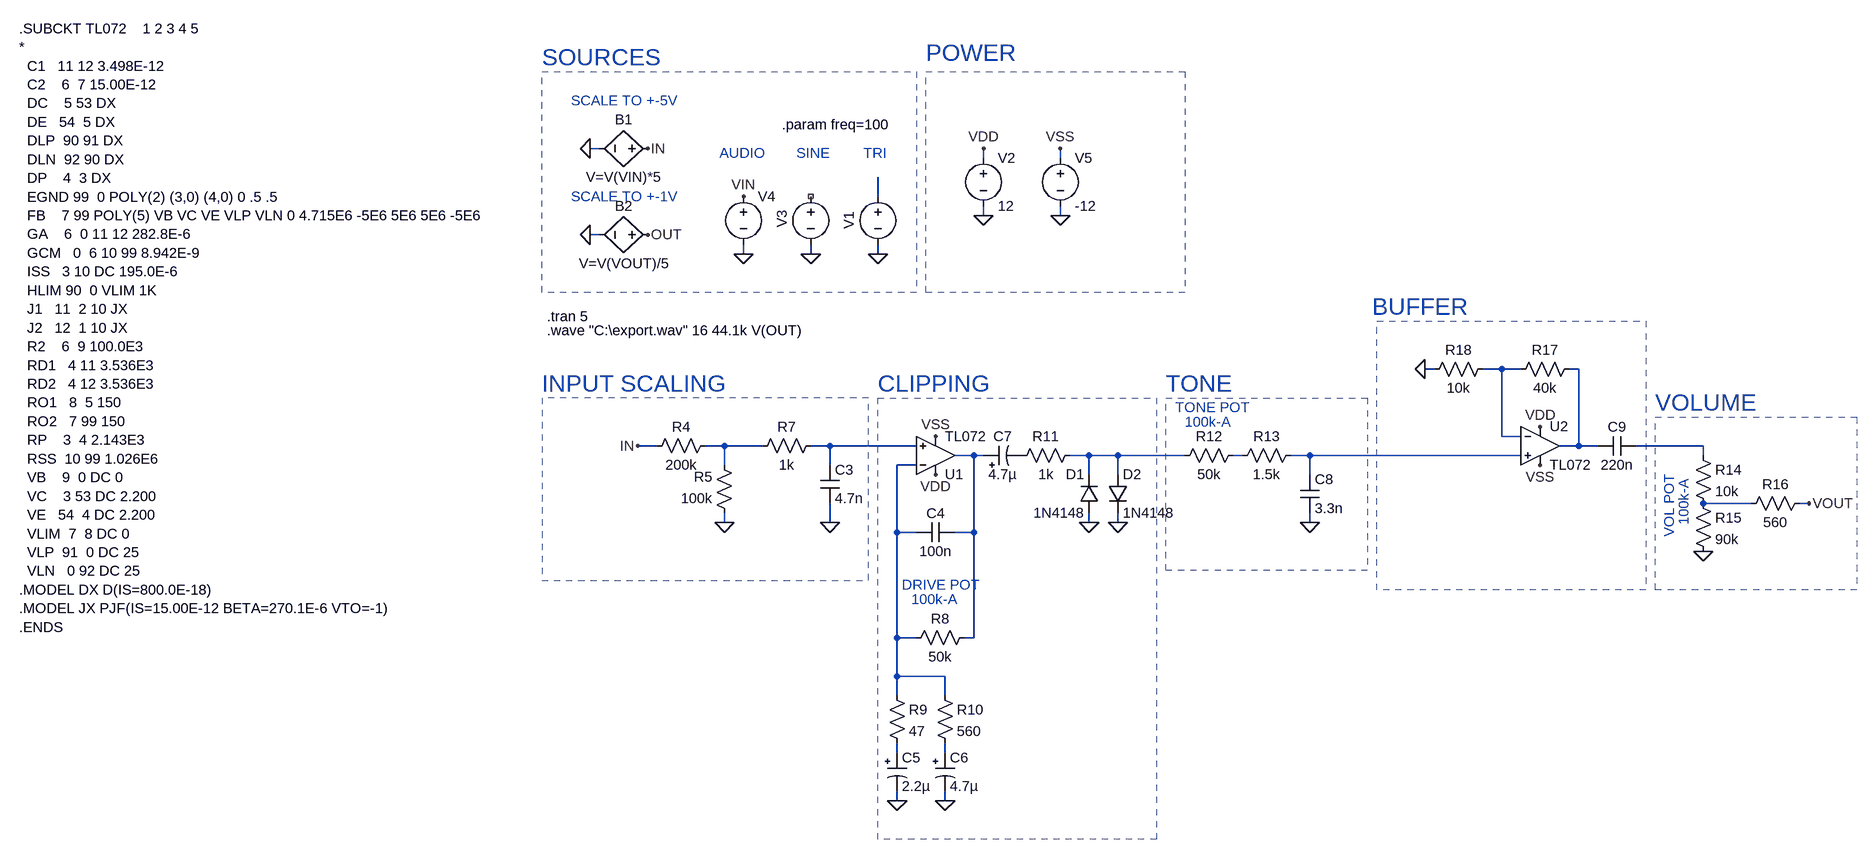
[diagram p0: schematic dist.asc]
dist.asc, the LTspice schematic file:
Version 4
SHEET 1 1972 1292
WIRE -160 112 -176 112
WIRE 480 128 480 112
WIRE 608 128 608 112
WIRE 304 192 304 160
WIRE 480 224 480 208
WIRE 608 224 608 208
WIRE -160 256 -176 256
WIRE 80 288 80 272
WIRE 192 288 192 272
WIRE 304 288 304 272
WIRE 1232 480 1216 480
WIRE 1344 480 1312 480
WIRE 1376 480 1344 480
WIRE 1472 480 1456 480
WIRE 1344 592 1344 480
WIRE 1376 592 1344 592
WIRE -64 608 -96 608
WIRE 48 608 16 608
WIRE 112 608 48 608
WIRE 224 608 192 608
WIRE 368 608 224 608
WIRE 1472 608 1472 480
WIRE 1472 608 1440 608
WIRE 1504 608 1472 608
WIRE 1680 608 1568 608
WIRE 464 624 432 624
WIRE 480 624 464 624
WIRE 656 624 624 624
WIRE 704 624 656 624
WIRE 816 624 704 624
WIRE 912 624 896 624
WIRE 1024 624 992 624
WIRE 1376 624 1024 624
WIRE 1680 624 1680 608
WIRE 48 640 48 608
WIRE 224 640 224 608
WIRE 368 640 336 640
WIRE 656 656 656 624
WIRE 704 656 704 624
WIRE 1024 656 1024 624
WIRE 1760 704 1680 704
WIRE 1856 704 1840 704
WIRE 48 736 48 720
WIRE 224 736 224 704
WIRE 656 736 656 720
WIRE 704 736 704 720
WIRE 1024 736 1024 720
WIRE 336 752 336 640
WIRE 368 752 336 752
WIRE 464 752 464 624
WIRE 464 752 432 752
WIRE 336 928 336 752
WIRE 368 928 336 928
WIRE 464 928 464 752
WIRE 464 928 448 928
WIRE 336 992 336 928
WIRE 416 992 336 992
WIRE 336 1024 336 992
WIRE 416 1024 416 992
WIRE 336 1120 336 1104
WIRE 416 1120 416 1104
WIRE 336 1200 336 1184
WIRE 416 1200 416 1184
FLAG 80 192 VIN
FLAG -80 112 IN
FLAG -80 256 OUT
FLAG -96 608 IN
FLAG 400 592 VSS
FLAG 400 656 VDD
FLAG 1856 704 VOUT
FLAG 1408 576 VDD
FLAG 1408 640 VSS
FLAG 608 224 0
FLAG 480 224 0
FLAG 608 112 VSS
FLAG 480 112 VDD
FLAG 80 288 0
FLAG 1680 784 0
FLAG 1024 736 0
FLAG 704 736 0
FLAG 656 736 0
FLAG 336 1200 0
FLAG 416 1200 0
FLAG 224 736 0
FLAG 1216 480 0
FLAG 48 736 0
FLAG 192 288 0
FLAG 304 288 0
FLAG -176 112 0
FLAG -176 256 0
SYMBOL voltage 304 176 R0
WINDOW 0 -32 56 VBottom 2
WINDOW 3 32 56 Invisible 2
WINDOW 123 0 0 Left 0
WINDOW 39 0 0 Left 0
SYMATTR InstName V1
SYMATTR Value PULSE(0 250m 0 {0.5/freq} {0.5/freq} 0 {1/freq})
SYMBOL voltage 480 112 R0
WINDOW 123 0 0 Left 0
WINDOW 39 0 0 Left 0
SYMATTR InstName V2
SYMATTR Value 12
SYMBOL voltage 192 176 R0
WINDOW 0 -47 39 VRight 2
WINDOW 3 24 96 Invisible 2
WINDOW 123 0 0 Left 0
WINDOW 39 0 0 Left 0
SYMATTR InstName V3
SYMATTR Value SINE(0 1 {freq})
SYMBOL voltage 80 176 R0
WINDOW 3 24 96 Invisible 2
SYMATTR Value wavefile="C:\input.wav" chan=0
SYMATTR InstName V4
SYMBOL bv -64 112 R90
WINDOW 0 -32 56 VBottom 2
WINDOW 3 32 56 VTop 2
SYMATTR InstName B1
SYMATTR Value V=V(VIN)*5
SYMBOL bv -64 256 R90
WINDOW 0 -32 56 VBottom 2
WINDOW 3 32 56 VTop 2
SYMATTR InstName B2
SYMATTR Value V=V(VOUT)/5
SYMBOL res 32 592 R90
WINDOW 0 0 56 VBottom 2
WINDOW 3 32 56 VTop 2
SYMATTR InstName R4
SYMATTR Value 200k
SYMBOL res 64 736 R180
WINDOW 0 36 76 Left 2
WINDOW 3 36 40 Left 2
SYMATTR InstName R5
SYMATTR Value 100k
SYMBOL OpAmps\\opamp2 400 688 M180
SYMATTR InstName U1
SYMATTR Value TL072
SYMBOL res 208 592 R90
WINDOW 0 0 56 VBottom 2
WINDOW 3 32 56 VTop 2
SYMATTR InstName R7
SYMATTR Value 1k
SYMBOL cap 208 640 R0
SYMATTR InstName C3
SYMATTR Value 4.7n
SYMBOL cap 432 736 R90
WINDOW 0 0 32 VBottom 2
WINDOW 3 32 32 VTop 2
SYMATTR InstName C4
SYMATTR Value 100n
SYMBOL res 464 912 R90
WINDOW 0 0 56 VBottom 2
WINDOW 3 32 56 VTop 2
SYMATTR InstName R8
SYMATTR Value 50k
SYMBOL res 320 1008 R0
SYMATTR InstName R9
SYMATTR Value 47
SYMBOL res 400 1008 R0
SYMATTR InstName R10
SYMATTR Value 560
SYMBOL polcap 320 1120 R0
SYMATTR InstName C5
SYMATTR Value 2.2µ
SYMBOL polcap 400 1120 R0
SYMATTR InstName C6
SYMATTR Value 4.7µ
SYMBOL polcap 480 640 R270
WINDOW 0 32 32 VTop 2
WINDOW 3 0 32 VBottom 2
SYMATTR InstName C7
SYMATTR Value 4.7µ
SYMBOL res 640 608 R90
WINDOW 0 0 56 VBottom 2
WINDOW 3 32 56 VTop 2
SYMATTR InstName R11
SYMATTR Value 1k
SYMBOL diode 672 720 R180
WINDOW 0 24 64 Left 2
WINDOW 3 24 0 Left 2
SYMATTR InstName D1
SYMATTR Value 1N4148
SYMBOL diode 688 656 R0
SYMATTR InstName D2
SYMATTR Value 1N4148
SYMBOL res 912 608 R90
WINDOW 0 0 56 VBottom 2
WINDOW 3 32 56 VTop 2
SYMATTR InstName R12
SYMATTR Value 50k
SYMBOL res 1008 608 R90
WINDOW 0 0 56 VBottom 2
WINDOW 3 32 56 VTop 2
SYMATTR InstName R13
SYMATTR Value 1.5k
SYMBOL cap 1008 656 R0
SYMATTR InstName C8
SYMATTR Value 3.3n
SYMBOL cap 1568 592 R90
WINDOW 0 0 32 VBottom 2
WINDOW 3 32 32 VTop 2
SYMATTR InstName C9
SYMATTR Value 220n
SYMBOL res 1664 608 R0
SYMATTR InstName R14
SYMATTR Value 10k
SYMBOL res 1664 688 R0
SYMATTR InstName R15
SYMATTR Value 90k
SYMBOL res 1856 688 R90
WINDOW 0 0 56 VBottom 2
WINDOW 3 32 56 VTop 2
SYMATTR InstName R16
SYMATTR Value 560
SYMBOL OpAmps\\opamp2 1408 544 R0
SYMATTR InstName U2
SYMATTR Value TL072
SYMBOL res 1472 464 R90
WINDOW 0 0 56 VBottom 2
WINDOW 3 32 56 VTop 2
SYMATTR InstName R17
SYMATTR Value 40k
SYMBOL res 1328 464 R90
WINDOW 0 0 56 VBottom 2
WINDOW 3 32 56 VTop 2
SYMATTR InstName R18
SYMATTR Value 10k
SYMBOL voltage 608 112 R0
WINDOW 123 0 0 Left 0
WINDOW 39 0 0 Left 0
SYMATTR InstName V5
SYMATTR Value -12
TEXT 144 72 Left 2 !.param freq=100
TEXT 168 120 Left 2 ;SINE
TEXT 280 120 Left 2 ;TRI
TEXT 40 120 Left 2 ;AUDIO
TEXT -256 -40 Left 4 ;SOURCES
TEXT 384 -48 Left 4 ;POWER
TEXT -208 32 Left 2 ;SCALE TO +-5V
TEXT -208 192 Left 2 ;SCALE TO +-1V
TEXT -1336 -88 Left 2 !.SUBCKT TL072    1 2 3 4 5\n*\n  C1   11 12 3.498E-12\n  C2    6  7 15.00E-12\n  DC    5 53 DX\n  DE   54  5 DX\n  DLP  90 91 DX\n  DLN  92 90 DX\n  DP    4  3 DX\n  EGND 99  0 POLY(2) (3,0) (4,0) 0 .5 .5\n  FB    7 99 POLY(5) VB VC VE VLP VLN 0 4.715E6 -5E6 5E6 5E6 -5E6\n  GA    6  0 11 12 282.8E-6\n  GCM   0  6 10 99 8.942E-9\n  ISS   3 10 DC 195.0E-6\n  HLIM 90  0 VLIM 1K\n  J1   11  2 10 JX\n  J2   12  1 10 JX\n  R2    6  9 100.0E3\n  RD1   4 11 3.536E3\n  RD2   4 12 3.536E3\n  RO1   8  5 150\n  RO2   7 99 150\n  RP    3  4 2.143E3\n  RSS  10 99 1.026E6\n  VB    9  0 DC 0\n  VC    3 53 DC 2.200\n  VE   54  4 DC 2.200\n  VLIM  7  8 DC 0\n  VLP  91  0 DC 25\n  VLN   0 92 DC 25\n.MODEL DX D(IS=800.0E-18)\n.MODEL JX PJF(IS=15.00E-12 BETA=270.1E-6 VTO=-1)\n.ENDS
TEXT -248 392 Left 2 !.tran 5
TEXT -248 416 Left 2 !.wave "C:\\export.wav" 16 44.1k V(OUT)
TEXT 800 544 Left 2 ;TONE POT
TEXT 816 568 Left 2 ;100k-A
TEXT 344 840 Left 2 ;DRIVE POT
TEXT 360 864 Left 2 ;100k-A
TEXT 304 504 Left 4 ;CLIPPING
TEXT -256 504 Left 4 ;INPUT SCALING
TEXT 784 504 Left 4 ;TONE
TEXT 1624 656 VRight 2 ;VOL POT
TEXT 1648 664 VRight 2 ;100k-A
TEXT 1128 376 Left 4 ;BUFFER
TEXT 1600 536 Left 4 ;VOLUME
RECTANGLE Normal 816 352 384 -16 1
RECTANGLE Normal 368 352 -256 -16 1
RECTANGLE Normal 768 1264 304 528 1
RECTANGLE Normal -256 832 288 528 1
RECTANGLE Normal 1120 816 784 528 1
RECTANGLE Normal 1584 848 1136 400 1
RECTANGLE Normal 1936 848 1600 560 1

The netlist it stands for:
* dist.asc
V1 N001 0 PULSE(0 250m 0 {0.5/freq} {0.5/freq} 0 {1/freq})
V2 VDD 0 12
V3 NC_01 0 SINE(0 1 {freq})
V4 VIN 0 wavefile="C:\input.wav" chan=0
B1 IN 0 V=V(VIN)*5
B2 OUT 0 V=V(VOUT)/5
R4 N004 IN 200k
R5 0 N004 100k
XU1 N005 N011 VDD VSS N007 TL072  ; pins In+ In- V+ V- OUT
R7 N005 N004 1k
C3 N005 0 4.7n
C4 N007 N011 100n
R8 N007 N011 50k
R9 N011 N013 47
R10 N011 N014 560
C5 N013 0 2.2µ
C6 N014 0 4.7µ
C7 N007 P001 4.7µ
R11 N008 P001 1k
D1 0 N008 1N4148
D2 N008 0 1N4148
R12 N009 N008 50k
R13 N010 N009 1.5k
C8 N010 0 3.3n
C9 N006 N003 220n
R14 N006 N012 10k
R15 N012 0 90k
R16 VOUT N012 560
XU2 N010 N002 VDD VSS N003 TL072  ; pins In+ In- V+ V- OUT
R17 N003 N002 40k
R18 N002 0 10k
V5 VSS 0 -12
.model D D
.lib standard.dio
.param freq=100
* SINE
* TRI
* AUDIO
* SOURCES
* POWER
* SCALE TO +-5V
* SCALE TO +-1V
.SUBCKT TL072    1 2 3 4 5
*
  C1   11 12 3.498E-12
  C2    6  7 15.00E-12
  DC    5 53 DX
  DE   54  5 DX
  DLP  90 91 DX
  DLN  92 90 DX
  DP    4  3 DX
  EGND 99  0 POLY(2) (3,0) (4,0) 0 .5 .5
  FB    7 99 POLY(5) VB VC VE VLP VLN 0 4.715E6 -5E6 5E6 5E6 -5E6
  GA    6  0 11 12 282.8E-6
  GCM   0  6 10 99 8.942E-9
  ISS   3 10 DC 195.0E-6
  HLIM 90  0 VLIM 1K
  J1   11  2 10 JX
  J2   12  1 10 JX
  R2    6  9 100.0E3
  RD1   4 11 3.536E3
  RD2   4 12 3.536E3
  RO1   8  5 150
  RO2   7 99 150
  RP    3  4 2.143E3
  RSS  10 99 1.026E6
  VB    9  0 DC 0
  VC    3 53 DC 2.200
  VE   54  4 DC 2.200
  VLIM  7  8 DC 0
  VLP  91  0 DC 25
  VLN   0 92 DC 25
.MODEL DX D(IS=800.0E-18)
.MODEL JX PJF(IS=15.00E-12 BETA=270.1E-6 VTO=-1)
.ENDS
.tran 5
.wave "C:\export.wav" 16 44.1k V(OUT)
* TONE POT
* 100k-A
* DRIVE POT
* 100k-A
* CLIPPING
* INPUT SCALING
* TONE
* VOL POT
* 100k-A
* BUFFER
* VOLUME
.backanno
.end